# Altium schematic sheet 05-AD8412.SchDoc
size A4
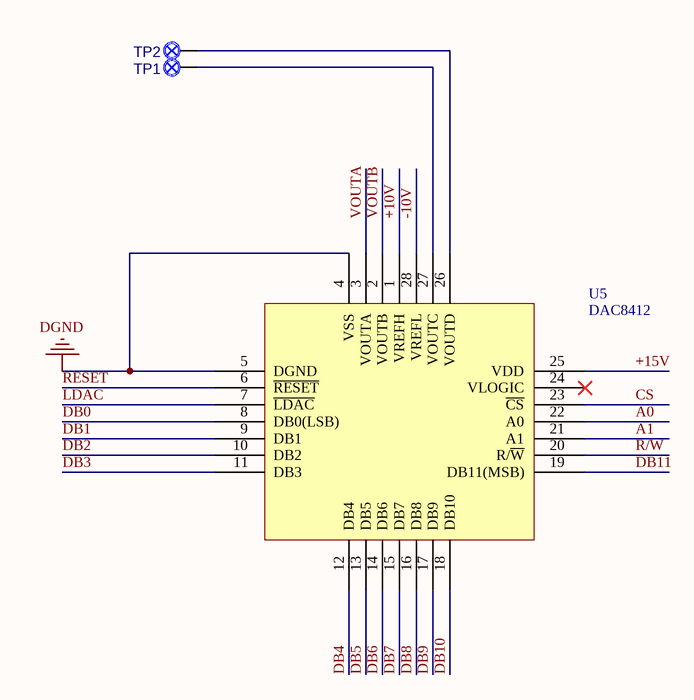
[diagram p0: 05-AD8412.SchDoc]

## Parts
TP1  TESTPOINT  [TP24-SMD]  (value not drawn)
TP2  TESTPOINT  [TP24-SMD]  (value not drawn)
U5  DAC8412  [PLCC-28_L11.5-W11.5-P1.27-LS12.5-L]

## Nets
DGND: U5.4(VSS) U5.5(DGND)
+10V: U5.1(VREFH)
+15V: U5.25(VDD)
-10V: U5.28(VREFL)
A0: U5.22(A0)
A1: U5.21(A1)
CS: U5.23(~{CS})
DB0: U5.8(DB0(LSB))
DB1: U5.9(DB1)
DB2: U5.10(DB2)
DB3: U5.11(DB3)
DB4: U5.12(DB4)
DB5: U5.13(DB5)
DB6: U5.14(DB6)
DB7: U5.15(DB7)
DB8: U5.16(DB8)
DB9: U5.17(DB9)
DB10: U5.18(DB10)
DB11: U5.19(DB11(MSB))
LDAC: U5.7(~{LDAC})
R/W: U5.20(R/~{W})
RESET: U5.6(~{RESET})
VOUTA: U5.3(VOUTA)
VOUTB: U5.2(VOUTB)
NetTP1_1: TP1.1 U5.27(VOUTC)
NetTP2_1: TP2.1 U5.26(VOUTD)

Not connected (* = marked no-connect by the designer): U5 24(VLOGIC)*

## Library data of the parts
TP1 TP2 = TESTPOINT_0: PARTS: 1; DEVICE: TEST-SMD; LEVEL: STD; OriginalSymbolOrigin: (20,20); PKG_TYPE: TP24-SMD; PCB Footprint: TP24-SMD